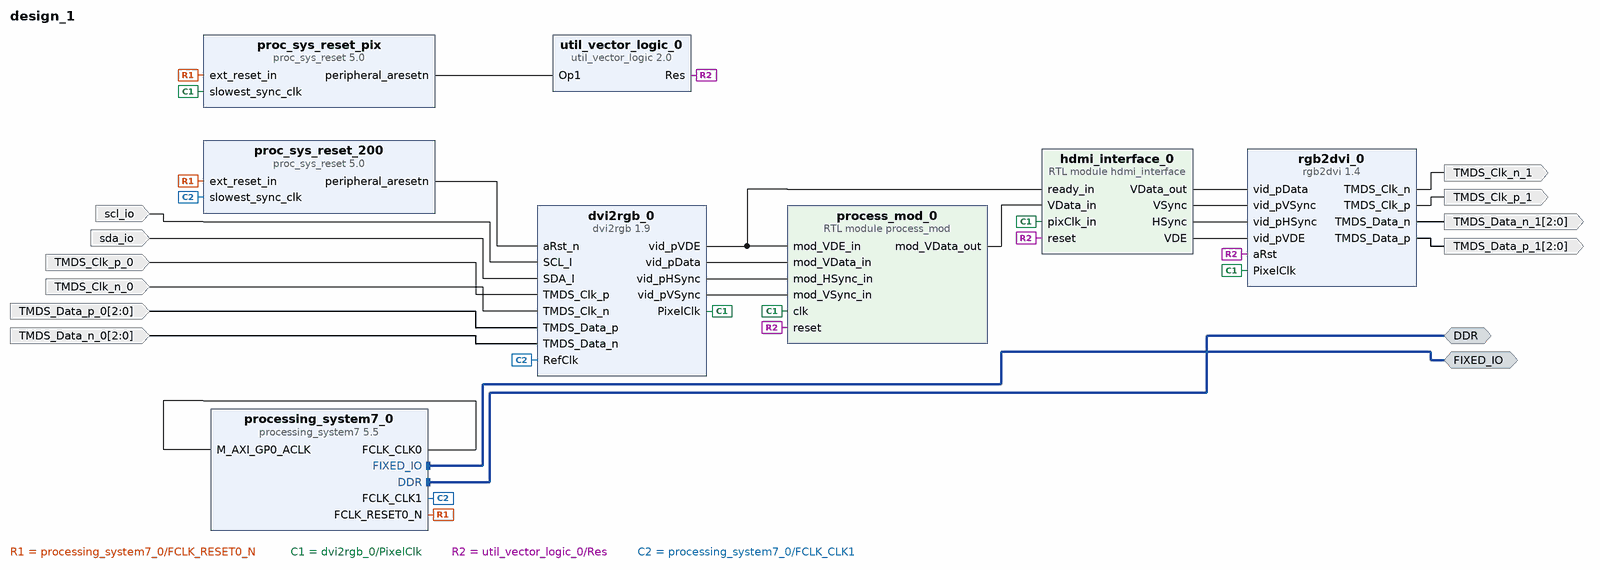
[diagram p0: block diagram of the top level]
# Vivado block design design_1, xc7z020clg400-1, Vivado 2020.1
create_bd_design design_1

create_bd_intf_port -mode Master -vlnv xilinx.com:interface:ddrx_rtl:1.0 DDR
create_bd_intf_port -mode Master -vlnv xilinx.com:display_processing_system7:fixedio_rtl:1.0 FIXED_IO
create_bd_port -dir I scl_io
create_bd_port -dir I sda_io
create_bd_port -dir I -type clk TMDS_Clk_p_0
create_bd_port -dir I -type clk TMDS_Clk_n_0
create_bd_port -dir I -from 2 -to 0 TMDS_Data_p_0
create_bd_port -dir I -from 2 -to 0 TMDS_Data_n_0
create_bd_port -dir O -type clk TMDS_Clk_p_1
create_bd_port -dir O -type clk TMDS_Clk_n_1
create_bd_port -dir O -from 2 -to 0 TMDS_Data_p_1
create_bd_port -dir O -from 2 -to 0 TMDS_Data_n_1

create_bd_cell -type ip -vlnv xilinx.com:ip:processing_system7:5.5 processing_system7_0
set_property -dict [list \
  CONFIG.PCW_APU_PERIPHERAL_FREQMHZ 650 \
  CONFIG.PCW_CRYSTAL_PERIPHERAL_FREQMHZ 50 \
  CONFIG.PCW_ENET0_ENET0_IO {MIO 16 .. 27} \
  CONFIG.PCW_ENET0_GRP_MDIO_ENABLE 1 \
  CONFIG.PCW_ENET0_GRP_MDIO_IO {MIO 52 .. 53} \
  CONFIG.PCW_ENET0_PERIPHERAL_ENABLE 1 \
  CONFIG.PCW_ENET0_RESET_ENABLE 1 \
  CONFIG.PCW_ENET0_RESET_IO {MIO 9} \
  CONFIG.PCW_ENET_RESET_ENABLE 1 \
  CONFIG.PCW_ENET_RESET_SELECT {Share reset pin} \
  CONFIG.PCW_EN_CLK1_PORT 1 \
  CONFIG.PCW_FPGA0_PERIPHERAL_FREQMHZ 100 \
  CONFIG.PCW_FPGA1_PERIPHERAL_FREQMHZ 100 \
  CONFIG.PCW_FPGA_FCLK1_ENABLE 1 \
  CONFIG.PCW_GPIO_MIO_GPIO_ENABLE 1 \
  CONFIG.PCW_GPIO_MIO_GPIO_IO MIO \
  CONFIG.PCW_I2C_RESET_ENABLE 1 \
  CONFIG.PCW_M_AXI_GP0_FREQMHZ 10 \
  CONFIG.PCW_PERIPHERAL_BOARD_PRESET part0 \
  CONFIG.PCW_PRESET_BANK1_VOLTAGE {LVCMOS 1.8V} \
  CONFIG.PCW_QSPI_GRP_FBCLK_ENABLE 1 \
  CONFIG.PCW_QSPI_GRP_FBCLK_IO {MIO 8} \
  CONFIG.PCW_QSPI_GRP_SINGLE_SS_ENABLE 1 \
  CONFIG.PCW_QSPI_GRP_SINGLE_SS_IO {MIO 1 .. 6} \
  CONFIG.PCW_QSPI_PERIPHERAL_ENABLE 1 \
  CONFIG.PCW_QSPI_QSPI_IO {MIO 1 .. 6} \
  CONFIG.PCW_SD0_GRP_CD_ENABLE 1 \
  CONFIG.PCW_SD0_GRP_CD_IO {MIO 47} \
  CONFIG.PCW_SD0_GRP_WP_ENABLE 0 \
  CONFIG.PCW_SD0_PERIPHERAL_ENABLE 1 \
  CONFIG.PCW_SD0_SD0_IO {MIO 40 .. 45} \
  CONFIG.PCW_SDIO_PERIPHERAL_FREQMHZ 50 \
  CONFIG.PCW_SINGLE_QSPI_DATA_MODE x4 \
  CONFIG.PCW_UART0_PERIPHERAL_ENABLE 1 \
  CONFIG.PCW_UART0_UART0_IO {MIO 14 .. 15} \
  CONFIG.PCW_UART1_PERIPHERAL_ENABLE 0 \
  CONFIG.PCW_UART_PERIPHERAL_FREQMHZ 100 \
  CONFIG.PCW_UIPARAM_DDR_BUS_WIDTH {16 Bit} \
  CONFIG.PCW_UIPARAM_DDR_FREQ_MHZ 525 \
  CONFIG.PCW_UIPARAM_DDR_PARTNO {MT41J256M16 RE-125} \
  CONFIG.PCW_USB0_PERIPHERAL_ENABLE 1 \
  CONFIG.PCW_USB0_RESET_ENABLE 1 \
  CONFIG.PCW_USB0_RESET_IO {MIO 46} \
  CONFIG.PCW_USB0_USB0_IO {MIO 28 .. 39} \
  CONFIG.PCW_USB_RESET_ENABLE 1 \
  CONFIG.PCW_USB_RESET_SELECT {Share reset pin} \
] [get_bd_cells processing_system7_0]
# 486 more settings of processing_system7_0 are not shown: defaults, MIO pin electricals, DDR timing, and values the tool derives
create_bd_cell -type ip -vlnv xilinx.com:ip:proc_sys_reset:5.0 proc_sys_reset_200
create_bd_cell -type ip -vlnv xilinx.com:ip:proc_sys_reset:5.0 proc_sys_reset_pix
create_bd_cell -type ip -vlnv xilinx.com:ip:util_vector_logic:2.0 util_vector_logic_0
set_property -dict {CONFIG.C_OPERATION not CONFIG.C_SIZE 1} [get_bd_cells util_vector_logic_0]
create_bd_cell -type ip -vlnv digilentinc.com:ip:rgb2dvi:1.4 rgb2dvi_0
set_property -dict {CONFIG.kClkRange 2} [get_bd_cells rgb2dvi_0]
create_bd_cell -type module -reference hdmi_interface hdmi_interface_0
create_bd_cell -type module -reference process_mod process_mod_0
create_bd_cell -type ip -vlnv digilentinc.com:ip:dvi2rgb:1.9 dvi2rgb_0
set_property -dict {CONFIG.kDebug false CONFIG.kRstActiveHigh false} [get_bd_cells dvi2rgb_0]

# ---- connections ----

connect_bd_intf_net [get_bd_intf_ports FIXED_IO] [get_bd_intf_pins processing_system7_0/FIXED_IO]
connect_bd_intf_net [get_bd_intf_ports DDR] [get_bd_intf_pins processing_system7_0/DDR]
connect_bd_net [get_bd_pins processing_system7_0/FCLK_CLK0] [get_bd_pins processing_system7_0/M_AXI_GP0_ACLK]
connect_bd_net [get_bd_pins processing_system7_0/FCLK_RESET0_N] \
  [get_bd_pins proc_sys_reset_200/ext_reset_in] [get_bd_pins proc_sys_reset_pix/ext_reset_in]
connect_bd_net [get_bd_pins proc_sys_reset_200/peripheral_aresetn] [get_bd_pins dvi2rgb_0/aRst_n]
connect_bd_net [get_bd_pins dvi2rgb_0/PixelClk] \
  [get_bd_pins proc_sys_reset_pix/slowest_sync_clk] [get_bd_pins rgb2dvi_0/PixelClk] [get_bd_pins hdmi_interface_0/pixClk_in] \
  [get_bd_pins process_mod_0/clk]
connect_bd_net [get_bd_pins proc_sys_reset_pix/peripheral_aresetn] [get_bd_pins util_vector_logic_0/Op1]
connect_bd_net [get_bd_pins util_vector_logic_0/Res] \
  [get_bd_pins rgb2dvi_0/aRst] [get_bd_pins hdmi_interface_0/reset] [get_bd_pins process_mod_0/reset]
connect_bd_net -net SCL_I_0_1 [get_bd_ports scl_io] [get_bd_pins dvi2rgb_0/SCL_I]
connect_bd_net -net SDA_I_0_1 [get_bd_ports sda_io] [get_bd_pins dvi2rgb_0/SDA_I]
connect_bd_net -net TMDS_Clk_p_0_1 [get_bd_ports TMDS_Clk_p_0] [get_bd_pins dvi2rgb_0/TMDS_Clk_p]
connect_bd_net -net TMDS_Clk_n_0_1 [get_bd_ports TMDS_Clk_n_0] [get_bd_pins dvi2rgb_0/TMDS_Clk_n]
connect_bd_net -net TMDS_Data_p_0_1 [get_bd_ports TMDS_Data_p_0] [get_bd_pins dvi2rgb_0/TMDS_Data_p]
connect_bd_net -net TMDS_Data_n_0_1 [get_bd_ports TMDS_Data_n_0] [get_bd_pins dvi2rgb_0/TMDS_Data_n]
connect_bd_net [get_bd_pins rgb2dvi_0/TMDS_Clk_p] [get_bd_ports TMDS_Clk_p_1]
connect_bd_net [get_bd_pins rgb2dvi_0/TMDS_Clk_n] [get_bd_ports TMDS_Clk_n_1]
connect_bd_net [get_bd_pins rgb2dvi_0/TMDS_Data_p] [get_bd_ports TMDS_Data_p_1]
connect_bd_net [get_bd_pins rgb2dvi_0/TMDS_Data_n] [get_bd_ports TMDS_Data_n_1]
connect_bd_net [get_bd_pins dvi2rgb_0/vid_pData] [get_bd_pins process_mod_0/mod_VData_in]
connect_bd_net [get_bd_pins dvi2rgb_0/vid_pHSync] [get_bd_pins process_mod_0/mod_HSync_in]
connect_bd_net [get_bd_pins dvi2rgb_0/vid_pVSync] [get_bd_pins process_mod_0/mod_VSync_in]
connect_bd_net [get_bd_pins dvi2rgb_0/vid_pVDE] [get_bd_pins hdmi_interface_0/ready_in] [get_bd_pins process_mod_0/mod_VDE_in]
connect_bd_net [get_bd_pins hdmi_interface_0/VData_out] [get_bd_pins rgb2dvi_0/vid_pData]
connect_bd_net [get_bd_pins hdmi_interface_0/VSync] [get_bd_pins rgb2dvi_0/vid_pVSync]
connect_bd_net [get_bd_pins hdmi_interface_0/HSync] [get_bd_pins rgb2dvi_0/vid_pHSync]
connect_bd_net [get_bd_pins hdmi_interface_0/VDE] [get_bd_pins rgb2dvi_0/vid_pVDE]
connect_bd_net [get_bd_pins process_mod_0/mod_VData_out] [get_bd_pins hdmi_interface_0/VData_in]
connect_bd_net [get_bd_pins processing_system7_0/FCLK_CLK1] [get_bd_pins proc_sys_reset_200/slowest_sync_clk] [get_bd_pins dvi2rgb_0/RefClk]

validate_bd_design
save_bd_design
